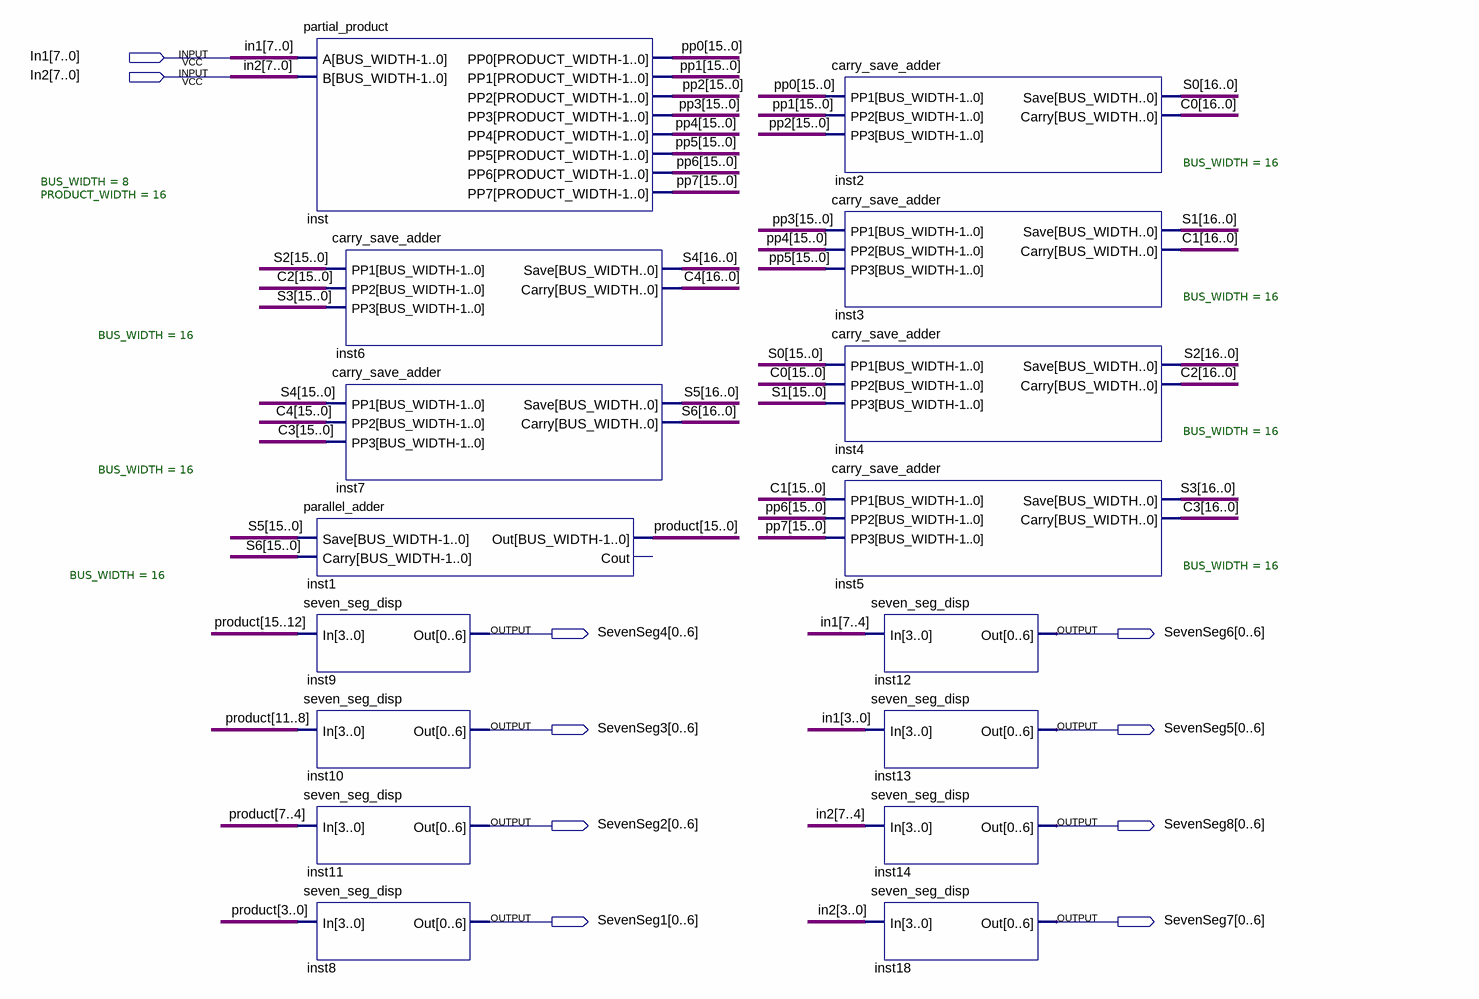
[diagram p0: schematic sheet]
// Quartus schematic wallace_alt.bdf as structural Verilog: 16 symbols, 10 pins
module wallace_alt (
  input  [7:0] In1,
  input  [7:0] In2,
  output [0:6] SevenSeg4,
  output [0:6] SevenSeg6,
  output [0:6] SevenSeg3,
  output [0:6] SevenSeg5,
  output [0:6] SevenSeg2,
  output [0:6] SevenSeg8,
  output [0:6] SevenSeg1,
  output [0:6] SevenSeg7
);

  wire [15:0] pp0, pp1, pp2, pp3, pp4, pp5, pp6, pp7, product;
  wire [16:0] C0, C1, C2, C3, C4, S0, S1, S2, S3, S4, S5, S6;

  partial_product #(.BUS_WIDTH(8), .PRODUCT_WIDTH(16)) inst (
    .A(In1), .B(In2), .PP0(pp0), .PP1(pp1), .PP2(pp2), .PP3(pp3), .PP4(pp4), .PP5(pp5), .PP6(pp6), .PP7(pp7));
  parallel_adder #(.BUS_WIDTH(16)) inst1 (.Save(S5[15:0]), .Carry(S6[15:0]), .Out(product));  // open: Cout
  seven_seg_disp inst9 (.In(product[15:12]), .Out(SevenSeg4));
  seven_seg_disp inst10 (.In(product[11:8]), .Out(SevenSeg3));
  seven_seg_disp inst11 (.In(product[7:4]), .Out(SevenSeg2));
  seven_seg_disp inst8 (.In(product[3:0]), .Out(SevenSeg1));
  carry_save_adder #(.BUS_WIDTH(16)) inst6 (.PP1(S2[15:0]), .PP2(C2[15:0]), .PP3(S3[15:0]), .Save(S4), .Carry(C4));
  carry_save_adder #(.BUS_WIDTH(16)) inst7 (.PP1(S4[15:0]), .PP2(C4[15:0]), .PP3(C3[15:0]), .Save(S5), .Carry(S6));
  carry_save_adder #(.BUS_WIDTH(16)) inst2 (.PP1(pp0), .PP2(pp1), .PP3(pp2), .Save(S0), .Carry(C0));
  carry_save_adder #(.BUS_WIDTH(16)) inst3 (.PP1(pp3), .PP2(pp4), .PP3(pp5), .Save(S1), .Carry(C1));
  carry_save_adder #(.BUS_WIDTH(16)) inst4 (.PP1(S0[15:0]), .PP2(C0[15:0]), .PP3(S1[15:0]), .Save(S2), .Carry(C2));
  carry_save_adder #(.BUS_WIDTH(16)) inst5 (.PP1(C1[15:0]), .PP2(pp6), .PP3(pp7), .Save(S3), .Carry(C3));
  seven_seg_disp inst12 (.In(In1[7:4]), .Out(SevenSeg6));
  seven_seg_disp inst13 (.In(In1[3:0]), .Out(SevenSeg5));
  seven_seg_disp inst14 (.In(In2[7:4]), .Out(SevenSeg8));
  seven_seg_disp inst18 (.In(In2[3:0]), .Out(SevenSeg7));
endmodule
